# EAGLE design Reverse Geocache schematic v0.1 (EAGLE 5.11)
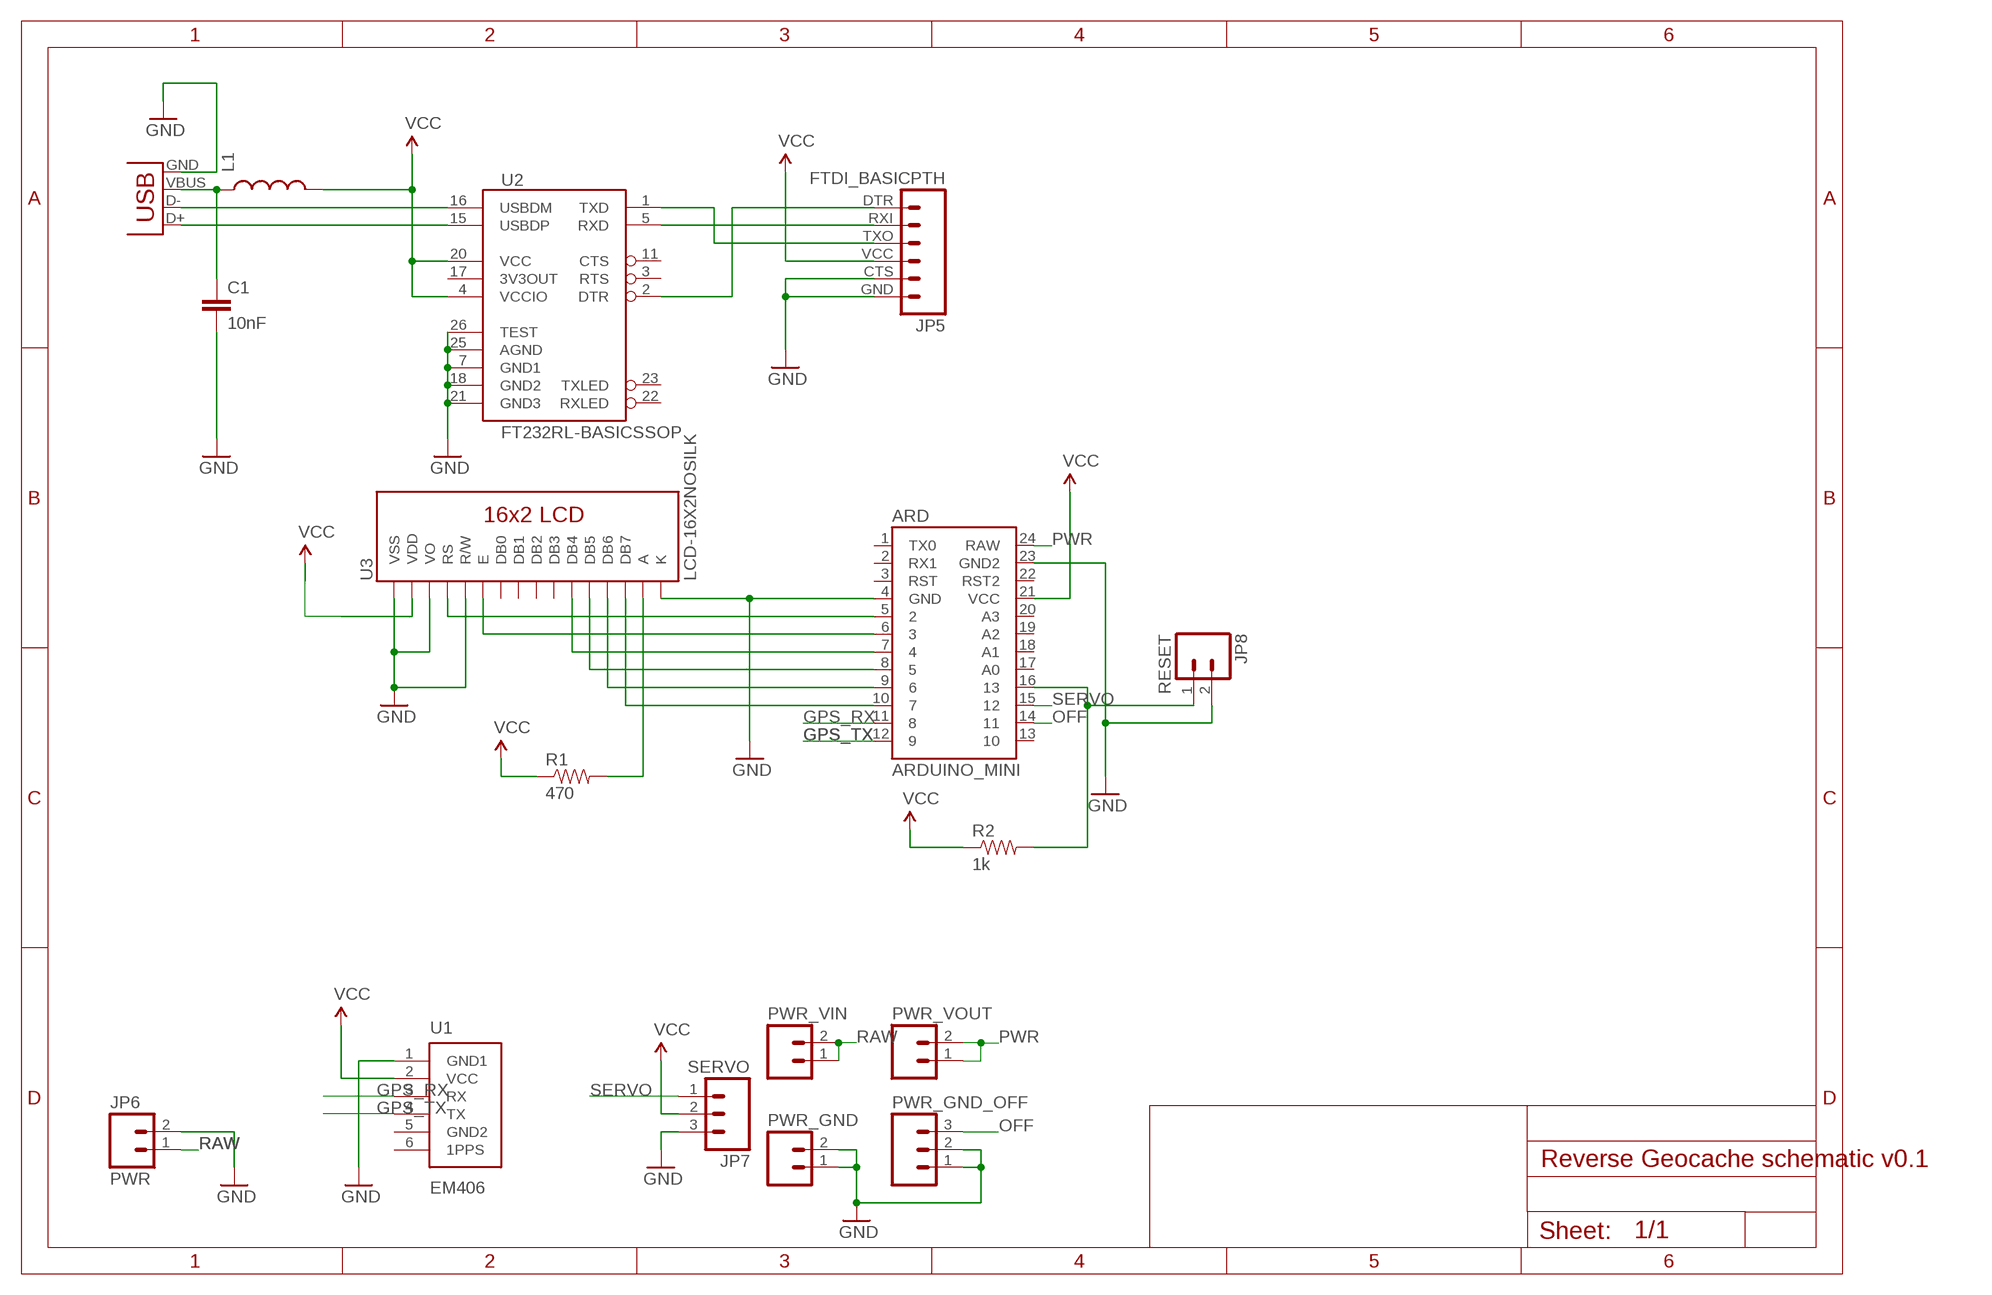
[diagram p0: schematic, sheet 1]

## Parts
ARD  ARDUINO_MINI  [ARDUINO_MINI]
C1  10nF  CAP0603-CAP  [0603-CAP]
JP5  FTDI_BASICPTH  [FTDI_BASIC]
JP6  PWR  M02POLAR  [MOLEX-1X2]
JP7  SERVO  M03PTH  [1X03]
JP8  RESET  M02PTH  [1X02]
L1  INDUCTOR0603  [0603]
PWR_GND  M02PTH  [1X02]
PWR_GND_OFF  M03PTH  [1X03]
PWR_VIN  M02PTH  [1X02]
PWR_VOUT  M02PTH  [1X02]
R1  470  RESISTORPTH-1/4W  [AXIAL-0.4]
R2  1k  RESISTORPTH-1/4W  [AXIAL-0.4]
U1  EM406  [EM406]
U2  FT232RL-BASICSSOP  [SSOP28DB]
U3  LCD-16X2NOSILK  [LCD-16X2_NOSILK]
X1  USBPTH-VERTICAL  [USB-B-PTH-VERTICAL]

## Nets
GND: ARD.4(GND) ARD.23(GND2) C1.2 JP5.CTS JP5.GND JP6.2 JP7.3 JP8.2 PWR_GND.1 PWR_GND.2 PWR_GND_OFF.1 PWR_GND_OFF.2 U1.1(GND1) U2.7(GND1) U2.18(GND2) U2.21(GND3) U2.25(AGND) U2.26(TEST) U3.1(VSS) U3.3(VO) U3.5(R/W) U3.16(K) X1.GND
GPS_RX: ARD.11 U1.3(RX)
GPS_TX: ARD.12 U1.4(TX)
N$1: U2.16(USBDM) X1.D-
N$2: U2.15(USBDP) X1.D+
N$3: C1.1 L1.1 X1.VBUS
N$4: ARD.5 U3.4(RS)
N$5: JP5.TXO U2.1(TXD)
N$6: JP5.RXI U2.5(RXD)
N$8: JP5.DTR U2.2(DTR)
N$10: R1.P$2 U3.15(A)
N$11: ARD.16 JP8.1 R2.P$2
N$12: ARD.6 U3.6(E)
N$13: ARD.7 U3.11(DB4)
N$14: ARD.8 U3.12(DB5)
N$15: ARD.9 U3.13(DB6)
N$16: ARD.10 U3.14(DB7)
OFF: ARD.14 PWR_GND_OFF.3
PWR: ARD.24(RAW) PWR_VOUT.1 PWR_VOUT.2
RAW: JP6.1 PWR_VIN.1 PWR_VIN.2
SERVO: ARD.15 JP7.1
VCC: ARD.21(VCC) JP5.VCC JP7.2 L1.2 R1.P$1 R2.P$1 U1.2(VCC) U2.4(VCCIO) U2.20(VCC) U3.2(VDD)
Unconnected: ARD.1(TX0) ARD.2(RX1) ARD.3(RST) ARD.13 ARD.17(A0) ARD.18(A1) ARD.19(A2) ARD.20(A3) ARD.22(RST2) U1.5(GND2) U1.6(1PPS) U2.3(RTS) U2.11(CTS) U2.17(3V3OUT) U2.22(RXLED) U2.23(TXLED) U3.7(DB0) U3.8(DB1) U3.9(DB2) U3.10(DB3)

## Library data of the parts
ARD = SparkFun:ARDUINO_MINI
C1 = SparkFun:CAP: Capacitor Standard 0603 ceramic capacitor, and 0.1" leaded capacitor.
JP5 = SparkFun:FTDI_BASIC: FTDI Basic: 3.3V and 5V
JP6 JP8 PWR_GND PWR_VIN PWR_VOUT = SparkFun:M02: Header 2 Standard 2-pin 0.1" header. Use with straight break away headers (SKU : PRT-00116), right angle break away headers (PRT-00553), swiss pins (PRT-00743), machine pins (PRT-00117), and female headers (PRT-00115). Molex polarized connector foot print use with SKU : PRT-08233 with associated crimp pins and housings.
JP7 PWR_GND_OFF = SparkFun:M03: Header 3 Standard 3-pin 0.1" header. Use with straight break away headers (SKU : PRT-00116), right angle break away headers (PRT-00553), swiss pins (PRT-00743), machine pins (PRT-00117), and female headers (PRT-00115). Molex polarized connector foot print use with SKU : PRT-08232 with associated crimp pins and housings.
L1 = SparkFun:INDUCTOR: Inductors Basic Inductor/Choke - 0603 and 1206. Footprints are not proven and vary greatly between part numbers.
R1 R2 = SparkFun:RESISTOR: Resistor Basic schematic elements and footprints for 0603, 1206, and PTH resistors.
U1 = SparkFun:EM406: EM406 Connector Proven layout and schematic for EM406 connector. Spark Fun Electronics SKU : GPS-00579
U2 = SparkFun:FT232RL-BASIC: USB UART This is the simplified version of the FT232RL unit. Only what you need, nothing you don't. Spark Fun Electronics SKU : COM-00650
U3 = SparkFun:LCD-16X2
X1 = SparkFun:USB: USB Connectors USB-B-PTH is fully proven SKU : PRT-00139 USB-miniB is fully proven SKU : PRT-00587 USB-A-PCB is untested. USB-A-H is throughly reviewed, but untested. Spark Fun Electronics SKU : PRT-00437 USB-B-SMT is throughly reviewed, but untested. Needs silkscreen touching up. USB-A-S has not been used/tested USB-MB-H has not been used/tested

## Board
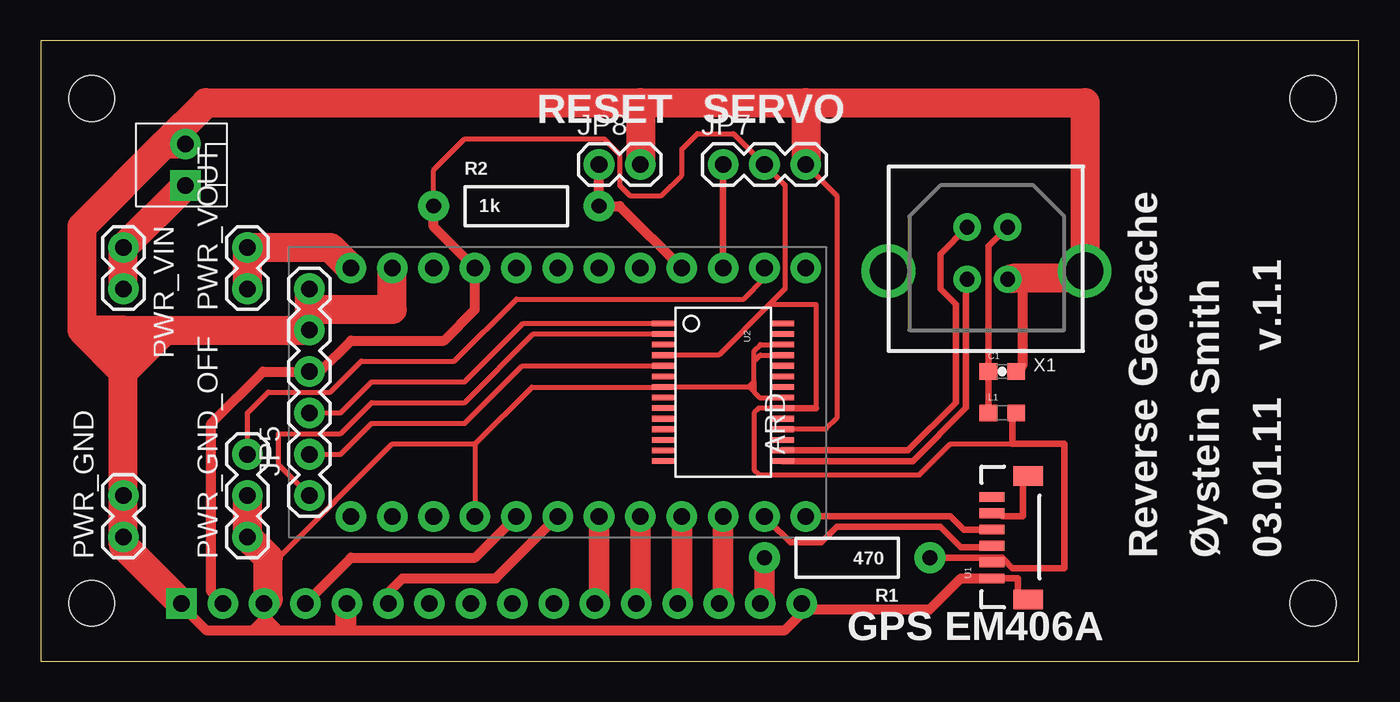
[diagram p1: board, top side]

Size 80.95 x 38.09 mm. Coordinates in mm from the lower left corner, seen from the top.
Outline: 0,0 80.95,0 80.95,38.09 0,38.09 0,0
Copper layers (1*16): Top 0.035mm / dielectric 1.5mm / Bottom 0.035mm
Design rules "default": minimum track width 10mil, minimum drill 24mil, track to track 8mil, track to pad 8mil, pad to pad 8mil, via to via 8mil, smd to smd 8mil, copper to edge 40mil, drill to drill 8mil, minimum pad ring 10mil, minimum via ring 8mil, stop-mask expansion 4mil, vias tented up to drill 0mil, thermal gap 10mil

### Footprints (pad centres in the part's own frame; a part is rotated, then mirrored left to right if it is on the bottom)
ARDUINO_MINI = drill 1.016 pad 1.88 round: 1 -7.62,12.7; 2 -7.62,10.16; 3 -7.62,7.62; 4 -7.62,5.08; 5 -7.62,2.54; 6 -7.62,0; 7 -7.62,-2.54; 8 -7.62,-5.08; 9 -7.62,-7.62; 10 -7.62,-10.16; 11 -7.62,-12.7; 12 -7.62,-15.24; 13 7.62,-15.24; 14 7.62,-12.7; 15 7.62,-10.16; 16 7.62,-7.62; 17 7.62,-5.08; 18 7.62,-2.54; 19 7.62,0; 20 7.62,2.54; 21 7.62,5.08; 22 7.62,7.62; 23 7.62,10.16; 24 7.62,12.7
0603-CAP = smd 1.1 x 1: 1 -0.85,0; 2 0.85,0
FTDI_BASIC = drill 1.016 pad 1.88 round: CTS 10.16,0; DTR 0,0; GND 12.7,0; RXI 2.54,0; TXO 5.08,0; VCC 7.62,0
MOLEX-1X2 = drill 1.016 pad 1.88 square: 1 0,0 | drill 1.016 pad 1.88 round: 2 2.54,0
1X03 = drill 1.016 pad 1.88 round: 1 0,0; 2 2.54,0; 3 5.08,0
1X02 = drill 1.016 pad 1.88 round: 1 0,0; 2 2.54,0
0603 = smd 1.1 x 1: 1 -0.85,0; 2 0.85,0
AXIAL-0.4 = drill 0.9 pad 1.88 round: P$1 -5.08,0; P$2 5.08,0
EM406 = smd 0.6 x 1.55: 1 0,0; 2 1,0; 3 2,0; 4 3,0; 5 4,0; 6 5,0 | smd 1.2 x 1.8: P$1 -1.3,-2.225; P$2 6.3,-2.225
SSOP28DB = smd 0.348 x 1.397: 1 -4.225,-3.656; 2 -3.575,-3.656; 3 -2.925,-3.656; 4 -2.275,-3.656; 5 -1.625,-3.656; 6 -0.975,-3.656; 7 -0.325,-3.656; 8 0.325,-3.656; 9 0.975,-3.656; 10 1.625,-3.656; 11 2.275,-3.656; 12 2.925,-3.656; 13 3.575,-3.656; 14 4.225,-3.656; 15 4.225,3.656; 16 3.575,3.656; 17 2.925,3.656; 18 2.275,3.656; 19 1.625,3.656; 20 0.975,3.656; 21 0.325,3.656; 22 -0.325,3.656; 23 -0.975,3.656; 24 -1.625,3.656; 25 -2.275,3.656; 26 -2.925,3.656; 27 -3.575,3.656; 28 -4.225,3.656
LCD-16X2_NOSILK = drill 1.016 pad 1.88 square: 1 -32,15.5 | drill 1.016 pad 1.88 round: 2 -29.46,15.5; 3 -26.92,15.5; 4 -24.38,15.5; 5 -21.84,15.5; 6 -19.3,15.5; 7 -16.76,15.5; 8 -14.22,15.5; 9 -11.68,15.5; 10 -9.14,15.5; 11 -6.6,15.5; 12 -4.06,15.5; 13 -1.52,15.5; 14 1.02,15.5; 15 3.56,15.5; 16 6.1,15.5 | hole 2.8: -37.5,15.5; -37.5,-15.5; 37.5,15.5; 37.5,-15.5
USB-B-PTH-VERTICAL = drill 0.914 pad 1.676 round: D+ 4.826,4.394; D- 4.826,7.595; GND 7.315,4.394; VBUS 7.315,7.595 | drill 2.286 round: P$1 0,4.902; P$2 12.04,4.902

### Placement (x,y rotation side)
ARD  31.75,16.51 90 top
C1  59.05,17.78 0 top
JP5  16.51,10.16 90 top
JP6  8.89,29.21 90 top
JP7  41.91,30.48 0 top
JP8  34.29,30.48 0 top
L1  59.05,15.24 0 top
PWR_GND  5.08,7.62 90 top
PWR_GND_OFF  12.7,7.62 90 top
PWR_VIN  5.08,25.4 270 top
PWR_VOUT  12.7,22.86 90 top
R1  49.53,6.35 180 top
R2  29.21,27.94 0 top
U1  58.42,5.08 90 top
U2  41.91,16.51 270 top
U3  40.64,19.05 180 bottom
X1  52.07,19.05 0 top

### Tracks (layer width: path | path; a pad name or v marks a point on that pad's centre or on a via)
GND
  Top 0.305: 43.51,16.84 U2.7 30.16,16.83 26.67,13.33 | 43.51,16.84 43.81,17.14 | U2.21 44.16,16.18 43.51,16.84 | U2.25 44.19,18.79 43.81,18.41 | 43.81,17.14 43.81,18.41 | U2.26 44.2,19.43 43.81,19.05 43.81,18.41 | 13.97,6.35 14.61,6.35 21.59,13.33 26.67,13.33 | 26.67,13.33 ARD.4 | U2.18 48.21,14.23 48.9,14.92 48.9,28.57 JP7.3 | 43.81,17.14 43.81,16.51
  Top 0.61: 13.97,3.81 13.97,2.54 14.61,1.91 | 14.61,1.91 18.41,1.91 | 18.41,1.91 45.72,1.91 46.67,2.86 46.67,3.17 46.99,3.17 | 18.41,1.91 18.41,3.17 18.73,3.49 | U3.5 18.73,3.49 | U1.1 56.52,5.08 54.61,3.17 46.99,3.17 | 46.99,3.17 46.99,3.49 46.8,3.49 U3.16 | 60.27,23.44 X1.GND | 60.33,23.5 60.27,23.44 | 60.27,23.44 60.27,18.15 C1.2 | 13.02,1.91 10.16,1.91 8.57,3.49 U3.1 | 13.65,1.91 14.61,1.91 | 13.65,3.49 13.65,2.54 13.02,1.91 | 13.02,1.91 13.65,1.91 | 13.65,1.91 13.97,2.22 | 18.73,3.49 19.05,3.17 19.05,2.22 18.73,2.22 18.73,2.86
  Top 1.27: 13.97,3.81 13.97,3.8 U3.3
  Top 1.778: PWR_GND_OFF.2 PWR_GND_OFF.1 13.97,6.35 13.97,3.81 | 16.51,21.59 JP5.CTS 7.62,20.32 | 16.51,21.59 JP5.GND | 7.62,31.75 JP6.2 | 7.62,31.75 2.54,26.67 2.54,20.32 | 16.51,21.59 21.59,21.59 ARD.23 | 5.08,20.32 7.62,20.32 | 7.62,31.75 10.16,34.29 36.83,34.29 | 36.83,34.29 JP8.2 | 36.83,34.29 46.99,34.29 | 46.99,34.29 JP7.3 | 46.99,34.29 64.14,34.29 64.14,23.5 60.33,23.5 59.69,23.5 | 5.08,20.32 2.54,20.32 | 5.08,17.78 PWR_GND.2 PWR_GND.1 5.08,7.11 U3.1 | 5.08,17.78 5.08,20.32 | 5.08,17.78 2.54,20.32 | 5.08,17.78 7.62,20.32
GPS_RX
  Top 0.406: U1.3 58.33,6.98 56.52,6.98 55.24,8.26 48.9,8.26 47.94,7.3 46.04,7.3 44.77,8.57 44.77,8.89 ARD.11
GPS_TX
  Top 0.406: U1.4 56.69,8.08 55.88,8.89 ARD.12
N$1
  Top 0.406: U2.16 53.26,12.93 56.2,15.88 56.2,21.91 55.24,22.86 55.24,24.99 X1.D-
N$2
  Top 0.406: U2.15 53.56,12.29 56.83,15.56 56.83,23.38 X1.D+
N$3
  Top 0.406: L1.1 C1.1 58.2,25.46 X1.VBUS
N$4
  Top 0.61: ARD.5 26.67,6.35 19.06,6.35 U3.4
N$5
  Top 0.305: U2.1 29.62,20.73 26.04,17.14 20.32,17.14 18.41,15.24 JP5.TXO
N$6
  Top 0.305: JP5.RXI 18.41,12.7 20.32,14.61 26.04,14.61 29.57,18.13 U2.5
N$7
  Top 0.406: 60.33,10.79 60.33,8.89 59.05,8.89
N$8
  Top 0.305: U2.2 30.25,20.09 26.04,15.88 20.32,15.88 18.41,13.97 14.61,13.97 14.61,12.06 JP5.DTR
N$9
  Top 0.406: 58.74,5.08 60.01,5.08 60.01,3.81
N$10
  Top 1.27: R1.P$2 44.45,3.81 U3.15
N$11
  Top 0.61: JP8.1 R2.P$2 35.56,27.94 ARD.16
N$12
  Top 0.61: U3.6 21.34,4.2 22.23,5.08 27.94,5.08 ARD.6
N$13
  Top 1.27: ARD.7 34.29,3.8 U3.11
N$14
  Top 1.27: ARD.8 36.83,3.8 U3.12
N$15
  Top 1.27: ARD.9 39.37,3.8 U3.13
N$16
  Top 1.27: ARD.10 41.91,3.8 U3.14
OFF
  Top 0.305: PWR_GND_OFF.3 12.7,15.24 13.97,16.51 17.78,16.51 19.68,18.41 25.4,18.41 29.21,22.22 43.18,22.22 44.45,23.5 ARD.14
PWR
  Top 1.778: PWR_VOUT.1 PWR_VOUT.2 17.78,25.4 ARD.24
RAW
  Top 1.778: PWR_VIN.2 PWR_VIN.1 JP6.1
SERVO
  Top 0.406: ARD.15 JP7.1
VCC
  Top 0.305: U2.4 41.65,18.79 44.77,21.91 | 44.77,21.91 45.72,22.86 45.72,29.21 JP7.2 42.55,32.38 40.32,32.38 39.37,31.43 39.37,29.84 38.1,28.57 36.2,28.57 35.56,29.21 35.56,31.11 34.61,32.07 26.04,32.07 24.13,30.16 24.13,26.67 | 44.77,21.91 47.62,21.91 47.62,15.54 44.11,15.54 43.81,15.24 43.81,11.75 44.13,11.43 53.98,11.43 55.88,13.33 60.01,13.33
  Top 0.406: 47.62,15.54 U2.20 | L1.2 59.69,15.03 59.69,13.33 60.01,13.33 62.87,13.33 62.87,5.71 59.69,5.71 59.05,6.35 58.42,6.35 | 58.42,6.35 R1.P$1 | 58.42,6.35 U1.2
  Top 0.61: R2.P$1 24.13,26.67 ARD.21 26.67,21.59 24.77,19.68 19.05,19.68 17.14,17.78 JP5.VCC 13.65,17.78 10.48,14.61 10.48,4.25 U3.2

### Text on the board
tPlace: RESET | SERVO | v.1.1 | Reverse Geocache | Øystein Smith | 03.01.11 | GPS EM406A